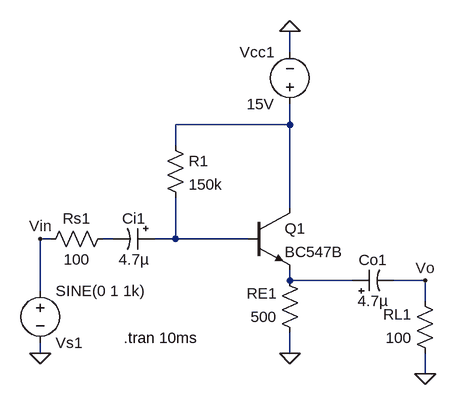
[diagram p0: schematic Lab4.2d.asc]
Lab4.2d.asc, the LTspice schematic file:
Version 4
SHEET 1 880 680
WIRE -32 -16 -32 -48
WIRE -32 96 -32 64
WIRE -32 96 -208 96
WIRE -208 128 -208 96
WIRE -32 224 -32 96
WIRE -400 272 -416 272
WIRE -304 272 -320 272
WIRE -208 272 -208 208
WIRE -208 272 -240 272
WIRE -96 272 -208 272
WIRE -32 336 -32 320
WIRE 64 336 -32 336
WIRE 176 336 128 336
WIRE -416 352 -416 272
WIRE 176 368 176 336
WIRE -416 448 -416 432
WIRE -32 448 -32 416
WIRE 176 480 176 448
FLAG -32 448 0
FLAG -32 -48 0
FLAG -416 448 0
FLAG 176 480 0
FLAG 176 336 Vo
FLAG -416 272 Vin
SYMBOL res -16 432 R180
WINDOW 0 36 76 Left 2
WINDOW 3 36 40 Left 2
SYMATTR InstName RE1
SYMATTR Value 500
SYMBOL npn -96 224 R0
SYMATTR InstName Q1
SYMATTR Value BC547B
SYMBOL voltage -32 80 R180
WINDOW 0 24 96 Left 2
WINDOW 3 24 16 Left 2
WINDOW 123 0 0 Left 0
WINDOW 39 0 0 Left 0
SYMATTR InstName Vcc1
SYMATTR Value 15V
SYMBOL res -224 112 R0
SYMATTR InstName R1
SYMATTR Value 150k
SYMBOL res -304 256 R90
WINDOW 0 0 56 VBottom 2
WINDOW 3 32 56 VTop 2
SYMATTR InstName Rs1
SYMATTR Value 100
SYMBOL res 192 464 R180
WINDOW 0 36 76 Left 2
WINDOW 3 36 40 Left 2
SYMATTR InstName RL1
SYMATTR Value 100
SYMBOL polcap -240 256 R90
WINDOW 0 0 32 VBottom 2
WINDOW 3 32 32 VTop 2
SYMATTR InstName Ci1
SYMATTR Value 4.7µ
SYMATTR Description Capacitor
SYMATTR Type cap
SYMATTR SpiceLine V=50 Irms=30m Rser=4.7 Lser=0 mfg="Nichicon" pn="UPR1H4R7MAH" type="Al electrolytic"
SYMBOL voltage -416 336 R0
WINDOW 0 24 96 Left 2
WINDOW 3 24 16 Left 2
WINDOW 123 0 0 Left 0
WINDOW 39 0 0 Left 0
SYMATTR InstName Vs1
SYMATTR Value SINE(0 1 1k)
SYMBOL polcap 64 352 R270
WINDOW 0 32 32 VTop 2
WINDOW 3 0 32 VBottom 2
SYMATTR InstName Co1
SYMATTR Value 4.7µ
SYMATTR Description Capacitor
SYMATTR Type cap
SYMATTR SpiceLine V=50 Irms=30m Rser=4.7 Lser=0 mfg="Nichicon" pn="UPR1H4R7MAH" type="Al electrolytic"
TEXT -288 424 Left 2 !.tran 10ms

The netlist it stands for:
* Lab4.2d.asc
RE1 0 N004 500
Q1 N001 N003 N004 0 BC547B
Vcc1 N001 0 15V
R1 N001 N003 150k
Rs1 N002 Vin 100
RL1 0 Vo 100
Ci1 N003 N002 4.7µ V=50 Irms=30m Rser=4.7 Lser=0 mfg="Nichicon" pn="UPR1H4R7MAH" type="Al electrolytic"
Vs1 Vin 0 SINE(0 1 1k)
Co1 N004 Vo 4.7µ V=50 Irms=30m Rser=4.7 Lser=0 mfg="Nichicon" pn="UPR1H4R7MAH" type="Al electrolytic"
.model NPN NPN
.model PNP PNP
.lib standard.bjt
.tran 10ms
.backanno
.end